# EAGLE schematic Powerboard (EAGLE 8.6.0)
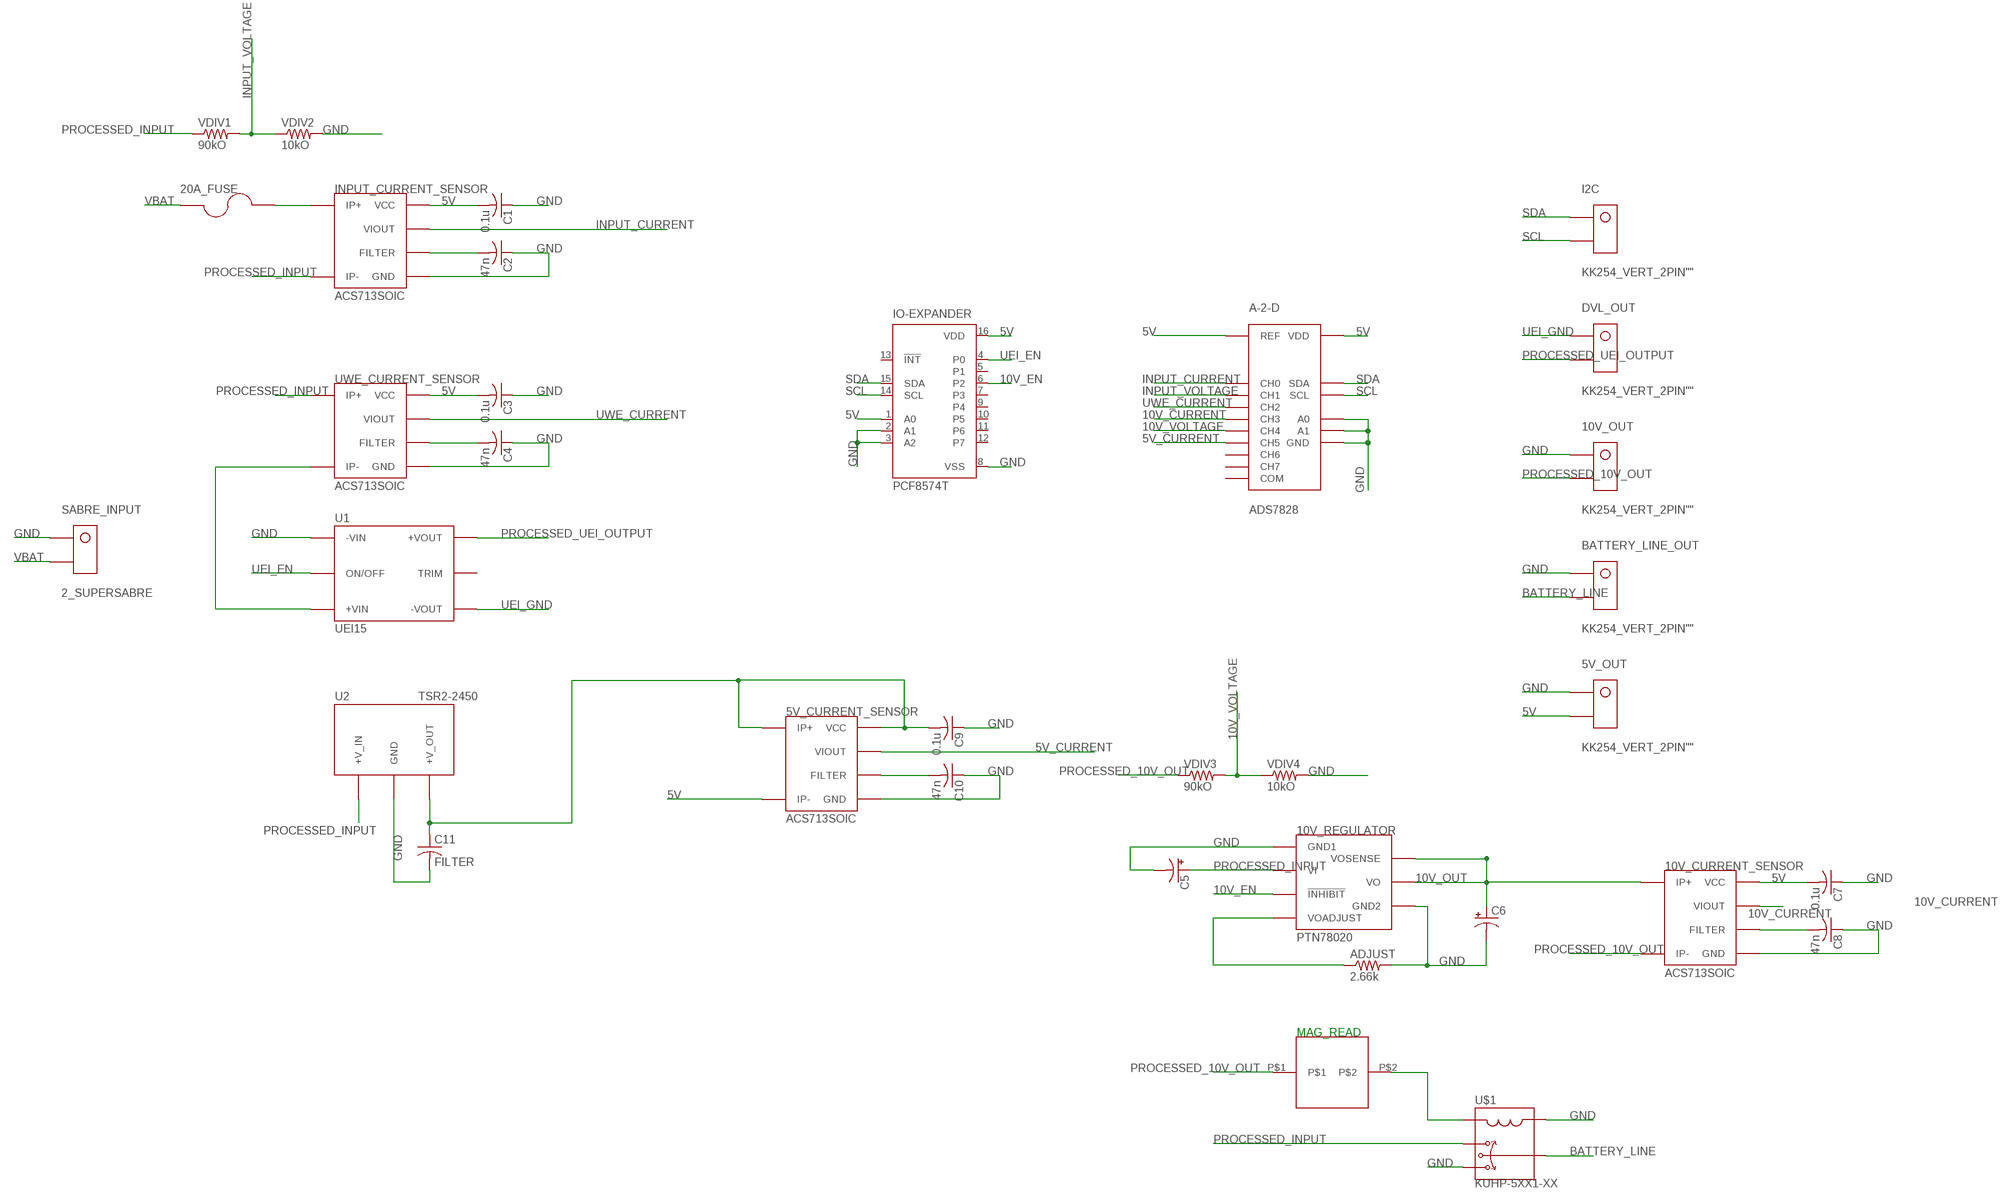
[diagram p0: schematic, sheet 1]

## Parts
5V_CURRENT_SENSOR  ACS713SOIC  [ACS713-SOIC]
5V_OUT  KK254_VERT_2PIN""  [KK254_VERT_2PIN]
10V_CURRENT_SENSOR  ACS713SOIC  [ACS713-SOIC]
10V_OUT  KK254_VERT_2PIN""  [KK254_VERT_2PIN]
10V_REGULATOR  PTN78020  [PTN]
20A_FUSE  BOWED-1.25"-FUSECLIPS  [1.25"_FUSECLIPS]
A-2-D  ADS7828  [TSSOP16]
ADJUST  2.66k  R-US_R0805  [R0805]
BATTERY_LINE_OUT  KK254_VERT_2PIN""  [KK254_VERT_2PIN]
C1  0.1u  C-USC0805  [C0805]
C2  47n  C-USC0805  [C0805]
C3  0.1u  C-USC0805  [C0805]
C4  47n  C-USC0805  [C0805]
C5  CPOL-US  [PANASONIC_A_TYPE_M]
C6  CPOL-US  [PANASONIC_A_TYPE_M]
C7  0.1u  C-USC0805  [C0805]
C8  47n  C-USC0805  [C0805]
C9  0.1u  C-USC0805  [C0805]
C10  47n  C-USC0805  [C0805]
C11  FILTER  C-USC0805  [C0805]
DVL_OUT  KK254_VERT_2PIN""  [KK254_VERT_2PIN]
I2C  KK254_VERT_2PIN""  [KK254_VERT_2PIN]
INPUT_CURRENT_SENSOR  ACS713SOIC  [ACS713-SOIC]
IO-EXPANDER  PCF8574T  [SO16W]
MAGREAD  HE151TR-ND  [HE151TR-ND]
SABRE_INPUT  2_SUPERSABRE  [SUPERSABRE_2CIRCUIT]
U1  UEI15  [UEI15]
U2  TSR2-2450  [TSR2]
U$1  KUHP-5XX1-XX  [KUHP_6.35MM-QUICK-CONNECT]
UWE_CURRENT_SENSOR  ACS713SOIC  [ACS713-SOIC]
VDIV1  90kO  R-US_R0805  [R0805]
VDIV2  10kO  R-US_R0805  [R0805]
VDIV3  90kO  R-US_R0805  [R0805]
VDIV4  10kO  R-US_R0805  [R0805]

## Nets
5V: 5V_CURRENT_SENSOR.P$3(IP-) 5V_CURRENT_SENSOR.P$4(IP-) 5V_OUT.P$2 10V_CURRENT_SENSOR.P$8(VCC) A-2-D.10(REF) A-2-D.16(VDD) C1.2 C3.2 C7.2 INPUT_CURRENT_SENSOR.P$8(VCC) IO-EXPANDER.1(A0) IO-EXPANDER.16(VDD) UWE_CURRENT_SENSOR.P$8(VCC)
5V_CURRENT: 5V_CURRENT_SENSOR.P$7(VIOUT) A-2-D.6(CH5)
10V_CURRENT: 10V_CURRENT_SENSOR.P$7(VIOUT) A-2-D.4(CH3)
10V_EN: 10V_REGULATOR.INHIBIT(!INHIBIT!) IO-EXPANDER.6(P2)
10V_OUT: 10V_CURRENT_SENSOR.P$1(IP+) 10V_CURRENT_SENSOR.P$2(IP+) 10V_REGULATOR.SENSE(VOSENSE) 10V_REGULATOR.VOUT(VO) C6.+
10V_VOLTAGE: A-2-D.5(CH4) VDIV3.2 VDIV4.1
BATTERY_LINE: BATTERY_LINE_OUT.P$2 U$1.7A U$1.7B
GND: 5V_CURRENT_SENSOR.P$5(GND) 5V_OUT.P$1 10V_CURRENT_SENSOR.P$5(GND) 10V_OUT.P$1 10V_REGULATOR.GND1 10V_REGULATOR.GND2 A-2-D.9(GND) A-2-D.12(A0) A-2-D.13(A1) ADJUST.2 BATTERY_LINE_OUT.P$1 C1.1 C2.1 C3.1 C4.1 C5.- C6.- C7.1 C8.1 C9.1 C10.1 C11.2 INPUT_CURRENT_SENSOR.P$5(GND) IO-EXPANDER.2(A1) IO-EXPANDER.3(A2) IO-EXPANDER.8(VSS) SABRE_INPUT.P$1 U1.-VIN U2.2(GND) U$1.5A U$1.5B U$1.AA(A) U$1.AB(A) UWE_CURRENT_SENSOR.P$5(GND) VDIV2.2 VDIV4.2
INPUT_CURRENT: A-2-D.1(CH0) INPUT_CURRENT_SENSOR.P$7(VIOUT)
INPUT_VOLTAGE: A-2-D.2(CH1) VDIV1.2 VDIV2.1
N$1: 20A_FUSE.P$3 20A_FUSE.P$4 INPUT_CURRENT_SENSOR.P$1(IP+) INPUT_CURRENT_SENSOR.P$2(IP+)
N$2: C2.2 INPUT_CURRENT_SENSOR.P$6(FILTER)
N$3: 5V_CURRENT_SENSOR.P$6(FILTER) C10.2
N$4: 5V_CURRENT_SENSOR.P$1(IP+) 5V_CURRENT_SENSOR.P$2(IP+) 5V_CURRENT_SENSOR.P$8(VCC) C9.2 C11.1 U2.3(+V_OUT)
N$5: 10V_REGULATOR.ADJUST(VOADJUST) ADJUST.1
N$6: U1.+VIN UWE_CURRENT_SENSOR.P$3(IP-) UWE_CURRENT_SENSOR.P$4(IP-)
N$7: C4.2 UWE_CURRENT_SENSOR.P$6(FILTER)
N$9: MAGREAD.P$2 U$1.BA(B) U$1.BB(B)
N$10: 10V_CURRENT_SENSOR.P$6(FILTER) C8.2
PROCESSED_10V_OUT: 10V_CURRENT_SENSOR.P$3(IP-) 10V_CURRENT_SENSOR.P$4(IP-) 10V_OUT.P$2 MAGREAD.P$1 VDIV3.1
PROCESSED_INPUT: 10V_REGULATOR.VIN(VI) C5.+ INPUT_CURRENT_SENSOR.P$3(IP-) INPUT_CURRENT_SENSOR.P$4(IP-) U2.1(+V_IN) U$1.2A U$1.2B UWE_CURRENT_SENSOR.P$1(IP+) UWE_CURRENT_SENSOR.P$2(IP+) VDIV1.1
PROCESSED_UEI_OUTPUT: DVL_OUT.P$2 U1.+VOUT
SCL: A-2-D.14(SCL) I2C.P$2 IO-EXPANDER.14(SCL)
SDA: A-2-D.15(SDA) I2C.P$1 IO-EXPANDER.15(SDA)
UEI_EN: IO-EXPANDER.4(P0) U1.ON/OFFCNTRL(ON/OFF)
UEI_GND: DVL_OUT.P$1 U1.-VOUT
UWE_CURRENT: A-2-D.3(CH2) UWE_CURRENT_SENSOR.P$7(VIOUT)
VBAT: 20A_FUSE.P$1 20A_FUSE.P$2 SABRE_INPUT.P$2
Unconnected: A-2-D.7(CH6) A-2-D.8(CH7) A-2-D.11(COM) IO-EXPANDER.5(P1) IO-EXPANDER.7(P3) IO-EXPANDER.9(P4) IO-EXPANDER.10(P5) IO-EXPANDER.11(P6) IO-EXPANDER.12(P7) IO-EXPANDER.13(!INT) U1.OTPTTRIM(TRIM)

## Notes on the sheet
- MAG_READ

## Library data of the parts
5V_CURRENT_SENSOR 10V_CURRENT_SENSOR INPUT_CURRENT_SENSOR UWE_CURRENT_SENSOR = allegro:ACS713
5V_OUT 10V_OUT BATTERY_LINE_OUT DVL_OUT I2C = molex:KK254_VERT_2PIN: KK® 254 Wire-to-Board Header, Vertical, with Friction Lock, 2 Circuits, Gold (Au) Plating Part Number: 22-29-2021 http://www.molex.com/molex/products/datasheet.jsp?part=active/0022292021_PCB_HEADERS.xml
10V_REGULATOR = texas:PTN
20A_FUSE = littelfuse:BOWED-1.25"-FUSECLIPS: Littelfuse 1.25" fuse clips with bowed leads
A-2-D = texas:ADS7828: Texas Instruments ADS7828 8-channel 12-bit I2C ADC Datasheet <http://www.ti.com/lit/ds/symlink/ads7828.pdf>
ADJUST VDIV1-VDIV4 = resistor:R-US_: RESISTOR, American symbol
C1-C4 C7-C11 = resistor:C-US: CAPACITOR, American symbol
C5 C6 = resistor:CPOL-US: POLARIZED CAPACITOR, American symbol
IO-EXPANDER = texas:PCF8574: I2C-Bus Remote 8-bit I/O expander http://www.semiconductors.philips.com/acrobat_download/datasheets/PCF8574_4.pdf; MPN: PCF8574T/3,512; OC_FARNELL: 1201255; OC_NEWARK: 70R6870
MAGREAD = magReed:HE151TR-ND
SABRE_INPUT = molex:2_SUPERSABRE: Molex SuperSabre 2-pin vertical header
U1 = murata:UEI15: The Murata UEI15 is an isolated wide input range 15W DC/DC Converter https://power.murata.com/data/power/mdc_uei-15w.pdf
U2 = tracoPower:TSR2-2450: The RSR2-2450 is a DC/DC Converter. https://www.mouser.com/ds/2/687/tsr2-datasheet-911338.pdf
U$1 = TE:KUHP-5XX1-XX: TE Connectivity KUHP-Series Relay Panel relays with quick-connect terminals Relay Datasheet <http://www.mouser.com/ds/2/418/NG_DS_1308242_KUHP_0914_KUHP_0914-713261.pdf> IMPORTANT NOTE: This part is designed using female PCB-mount spade terminals. Part: Keystone Electronics 0.25"x0.032" PC quick-fit terminals (Part No. 3528). Datasheet <http://www.mouser.com/ds/2/215/528-745365.pdf>